# EAGLE schematic lpi2 (EAGLE 6.5.0)
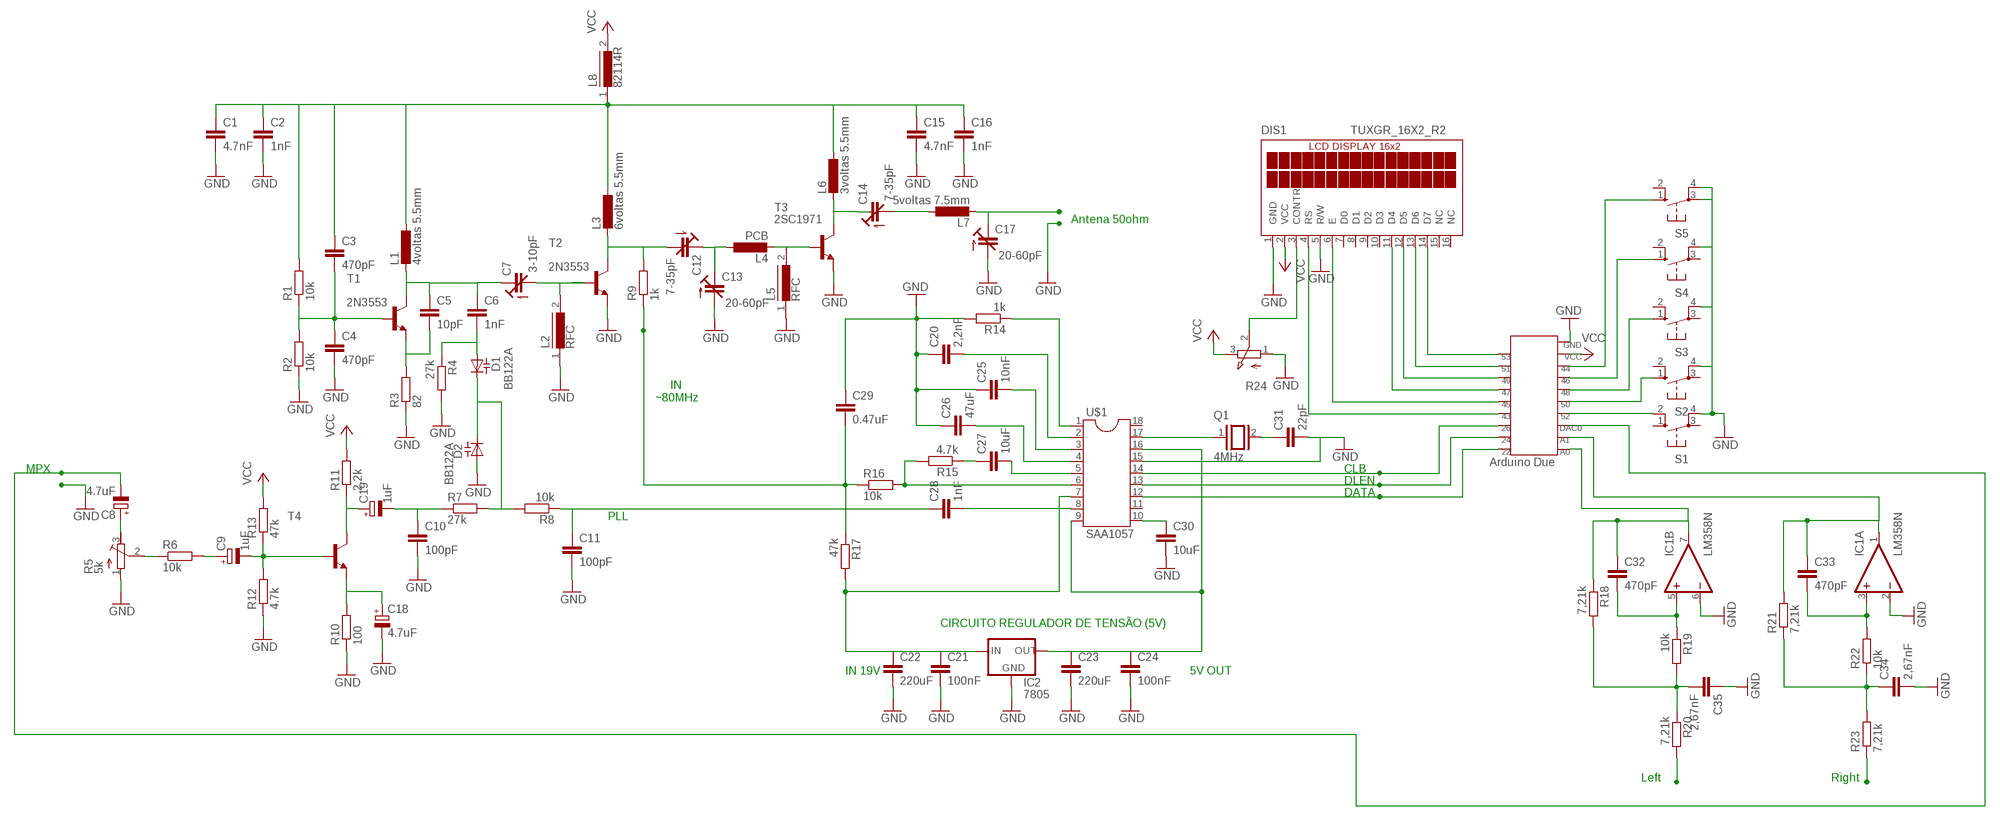
[diagram p0: schematic, sheet 1]

## Parts
C1  4.7nF  C-EU025-024X044  [C025-024X044]
C2  1nF  C-EU025-024X044  [C025-024X044]
C3  470pF  C-EU025-024X044  [C025-024X044]
C4  470pF  C-EU025-024X044  [C025-024X044]
C5  10pF  C-EU025-024X044  [C025-024X044]
C6  1nF  C-EU025-024X044  [C025-024X044]
C7  3-10pF  C-TRIMM808  [CTRIM808-BC]
C8  4.7uF  CPOL-EUE2.5-6  [E2,5-6]
C9  1uF  CPOL-EUE2.5-6  [E2,5-6]
C10  100pF  C-EU025-024X044  [C025-024X044]
C11  100pF  C-EU025-024X044  [C025-024X044]
C12  7-35pF  C-TRIMM808  [CTRIM808-BC]
C13  20-60pF  C-TRIMM808  [CTRIM808-BC]
C14  7-35pF  C-TRIMM808  [CTRIM808-BC]
C15  4.7nF  C-EU025-024X044  [C025-024X044]
C16  1nF  C-EU025-024X044  [C025-024X044]
C17  20-60pF  C-TRIMM808  [CTRIM808-BC]
C18  4.7uF  CPOL-EUE2.5-6  [E2,5-6]
C19  1uF  CPOL-EUE2.5-6  [E2,5-6]
C20  2,2nF  C-EU025-024X044  [C025-024X044]
C21  100nF  C-EU025-024X044  [C025-024X044]
C22  220uF  C-EU025-024X044  [C025-024X044]
C23  220uF  C-EU025-024X044  [C025-024X044]
C24  100nF  C-EU025-024X044  [C025-024X044]
C25  10nF  C-EU025-024X044  [C025-024X044]
C26  47uF  C-EU025-024X044  [C025-024X044]
C27  10uF  C-EU025-024X044  [C025-024X044]
C28  1nF  C-EU025-024X044  [C025-024X044]
C29  0.47uF  C-EU025-024X044  [C025-024X044]
C30  10uF  C-EU025-024X044  [C025-024X044]
C31  22pF  C-EU025-024X044  [C025-024X044]
C32  470pF  C-EU025-024X044  [C025-024X044]
C33  470pF  C-EU025-024X044  [C025-024X044]
C34  2,67nF  C-EU025-024X044  [C025-024X044]
C35  2,67nF  C-EU025-024X044  [C025-024X044]
D1  BB112  [SOT54H]
D2  BB112  [SOT54H]
DIS1  TUXGR_16X2_R2  [TUXGR_16X2_R2]
IC1  LM358N  [DIL08]
IC2  7805  78XXL  [78XXL]
IC3  DIL20  [DIL20]
L1  4voltas 5.5mm  L-EU0204/5  [0204/5]
L2  RFC  82114R  [82114R]
L3  6voltas 5.5mm  L-EU0204/5  [0204/5]
L4  PCB  L-EU0204/5  [0204/5]
L5  RFC  82114R  [82114R]
L6  3voltas 5.5mm  L-EU0204/5  [0204/5]
L7  5voltas 7.5mm  L-EU0204/5  [0204/5]
L8  82114R  [82114R]
Q1  4MHz  XTAL  [Q]
R1  10k  R-EU_0204/2V  [0204V]
R2  10k  R-EU_0204/2V  [0204V]
R3  82  R-EU_0204/2V  [0204V]
R4  27k  R-EU_0204/2V  [0204V]
R5  5k  R-TRIMM4G/J  [RTRIM4G/J]
R6  10k  R-EU_0204/2V  [0204V]
R7  27k  R-EU_0204/2V  [0204V]
R8  10k  R-EU_0204/2V  [0204V]
R9  1k  R-EU_0204/2V  [0204V]
R10  100  R-EU_0204/2V  [0204V]
R11  2.2k  R-EU_0204/2V  [0204V]
R12  4.7k  R-EU_0204/2V  [0204V]
R13  47k  R-EU_0204/2V  [0204V]
R14  1k  R-EU_0204/2V  [0204V]
R15  4.7k  R-EU_0204/2V  [0204V]
R16  10k  R-EU_0204/2V  [0204V]
R17  47k  R-EU_0204/2V  [0204V]
R18  7,21k  R-EU_0204/2V  [0204V]
R19  10k  R-EU_0204/2V  [0204V]
R20  7,21k  R-EU_0204/2V  [0204V]
R21  7,21k  R-EU_0204/2V  [0204V]
R22  10k  R-EU_0204/2V  [0204V]
R23  7,21k  R-EU_0204/2V  [0204V]
R24  3RP/1610N  [3RP/1610N]
S1  10-XX  [B3F-10XX]
S2  10-XX  [B3F-10XX]
S3  10-XX  [B3F-10XX]
S4  10-XX  [B3F-10XX]
S5  10-XX  [B3F-10XX]
T1  2N2219  [TO5]
T2  2N2219  [TO5]
T3  2SC1969AV  [T-30_V]
T4  BC547  [TO92]
U$1  SAA1057  [DIP-18]

## Nets
GND: C1.2 C2.2 C4.2 C10.2 C11.2 C13.2(A) C15.2 C16.2 C17.2(A) C18.- C20.1 C21.2 C22.2 C23.2 C24.2 C25.1 C26.1 C29.1 C30.2 C31.2 C34.2 C35.1 D2.A DIS1.1(GND) DIS1.5(R/W) IC1.2(A:-IN) IC1.6(B:-IN) IC2.GND L2.1 L5.1 R2.1 R3.1 R4.2 R5.1(E) R10.1 R12.1 R14.2 R24.1(A) S1.4(P1) S2.4(P1) S3.4(P1) S4.4(P1) S5.4(P1) T2.1(E) T3.3(E) U$1.15(VEE)
L8: C1.1 C2.1 C3.1 C15.1 C16.1 L1.1 L3.1 L6.1 L8.1 R1.2
N$1: L4.2 L5.2 T3.1(B)
N$2: C6.2 D1.A R4.1
N$3: C14.1(E) L6.2 T3.2(C)
N$4: D1.C D2.C R7.2 R8.2
N$5: C3.2 C4.1 R1.1 R2.2 T1.2(B)
N$6: C9.- R12.2 R13.1 T4.2(B)
N$7: C8.+ R5.3(A)
N$8: C11.1 C28.1 R8.1
N$9: C29.2
N$10: R5.2(S) R6.1
N$11: C9.+ R6.2
N$13: C17.1(E) L7.2
N$14: C12.1(E) C13.1(E) L4.1
N$15: C7.2(A) L2.2 T2.2(B)
N$16: C5.1 C6.1 C7.1(E) L1.2 T1.3(C)
N$17: C5.2 R3.2 T1.1(E)
N$18: R14.1 U$1.1(TR)
N$19: C27.2 U$1.5(IN)
N$20: C10.1 C19.- R7.1
N$21: C18.+ R10.2 T4.1(E)
N$22: C20.2 U$1.2(TCA)
N$23: C19.+ R11.1 T4.3(C)
N$24: C21.1 C22.1 IC2.IN R17.2 U$1.7(VCC3)
N$25: C25.2 U$1.3(TCB)
N$26: C12.2(A) L3.2 R9.2 T2.3(C)
N$27: C26.2 U$1.4(DCS)
N$28: C14.2(A) L7.1
N$29: DIS1.13(D6)
N$30: C27.1 R15.1
N$31: R15.2 R16.2 U$1.6(OUT)
N$32: C23.1 C24.1 IC2.OUT U$1.9(VCC1) U$1.16(VCC2)
N$33: C28.2 U$1.8(FFM)
N$34: C33.2 IC1.3(A:+IN) R22.2
N$35: R9.1 R16.1 R17.1
N$36: C8.-
N$37: C34.1 R21.1 R22.1 R23.2
N$38: C30.1 U$1.10(DCA)
N$39: Q1.1 U$1.17(XTAL)
N$40: C31.1 Q1.2
N$41: R23.1
N$42: C32.1 IC1.7(B:OUT) R18.1
N$43: U$1.12(DATA)
N$44: U$1.13(DLEN)
N$45: U$1.14(CLB)
N$46: S1.2(S1)
N$47: C32.2 IC1.5(B:+IN) R19.1
N$48: DIS1.4(RS)
N$49: C35.2 R18.2 R19.2 R20.1
N$50: R20.2
N$51: C33.1 IC1.1(A:OUT) R21.2
N$52: DIS1.6(E)
N$53: DIS1.11(D4)
N$54: S2.1(S)
N$55: S3.1(S)
N$56: S4.1(S)
N$57: S5.3(P)
N$58: DIS1.12(D5)
N$59: DIS1.14(D7)
N$60: DIS1.3(CONTR) R24.2(S)
N$61: S5.1(S)
VCC: DIS1.2(VCC) L8.2 R11.2 R13.2 R24.3(E)
Unconnected: DIS1.7(D0) DIS1.8(D1) DIS1.9(D2) DIS1.10(D3) DIS1.15(NC) DIS1.16(NC) S1.1(S) S1.3(P) S2.2(S1) S2.3(P) S3.2(S1) S3.3(P) S4.2(S1) S4.3(P) S5.2(S1) U$1.11(FAM) U$1.18(TEST)

## Notes on the sheet
- 2SC1971 | Antena 50ohm
- 2N3553
- 2N3553
- BB122A
- IN
  ~80MHz
- MPX | CLB
- BB122A | DLEN
- DATA
- PLL
- CIRCUITO REGULADOR DE TENSÃO (5V)
- IN 19V | 5V OUT
- Left | Right

## Power pins joined to a net without a drawn wire
V+: IC1.8(P:V+)
V-: IC1.4(P:V-)

## Library data of the parts
C1-C6 C10 C11 C15 C16 C20-C35 = resistor:C-EU: CAPACITOR, European symbol
C7 C12-C14 C17 = resistor:C-TRIMM: Trimm capacitor
C8 C9 C18 C19 = resistor:CPOL-EU: POLARIZED CAPACITOR, European symbol
D1 D2 = diode:BB112: Capacity DIODE variable-capacitance diode
DIS1 = display-lcd:TUXGR_16X2_R2: Tuxgraphics LCD display 16x2 characters reflective, without background light Source: tuxgr_12x2_r2.pdf; OC_FARNELL: unknown; OC_NEWARK: unknown
IC1 = linear:LM358: OP AMP also LM158; LM258; LM2904 Source: http://cache.national.com/ds/LM/LM158.pdf
IC2 = v-reg:78XXL: VOLTAGE REGULATOR
IC3 = ic-package:DIL20: Dual In Line / Socket
L1 L3 L4 L6 L7 = resistor:L-EU: INDUCTOR, European symbol
L2 L5 L8 = inductors:82114R: INDUCTOR
Q1 = special:XTAL: CRYSTAL
R1-R4 R6-R23 = resistor:R-EU_: RESISTOR, European symbol
R5 = resistor:R-TRIMM: Trimm resistor
R24 = pot:3RP/1610N: 16mm Potentiometer one level Source: http://www.alphapotentiometers.net/html/16mm_pot_2.html
S1-S5 = switch-omron:10-XX: OMRON SWITCH; MPN: B3F-1000; OC_FARNELL: 176432; OC_NEWARK: 36M3542
T1 T2 = transistor:2N2219: NPN TRANSISTOR
T3 = transistor:2SC1969: NPN Epitaxial Planar Transistor RF Power Amplifier Source: 2sc1969.pdf
T4 = transistor:BC547: NPN TRANSISTOR
U$1 = mylibrarie:SAA1057